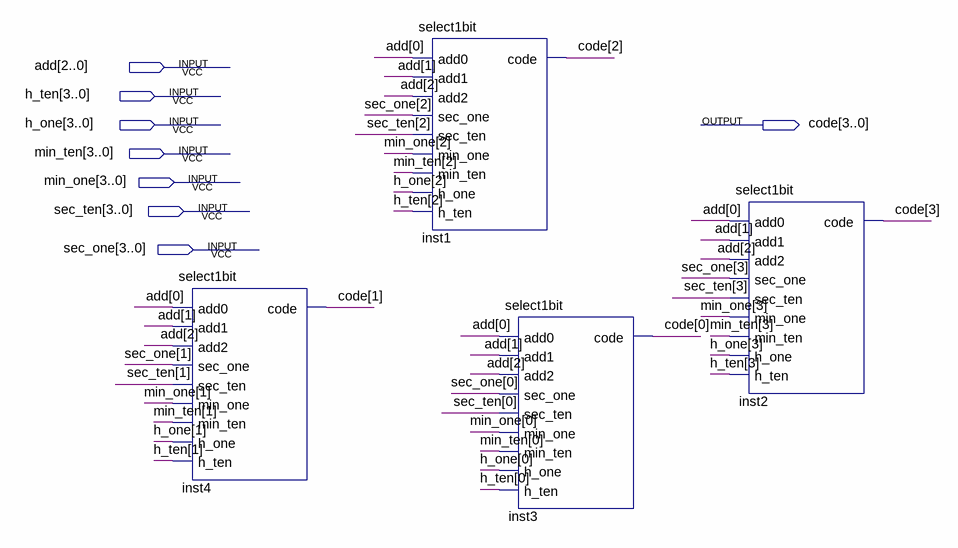
[diagram p0: schematic sheet]
// Quartus schematic seg_select.bdf as structural Verilog: 4 symbols, 8 pins
module seg_select (
  input  [2:0] add,
  input  [3:0] h_ten,
  input  [3:0] h_one,
  input  [3:0] min_ten,
  input  [3:0] min_one,
  input  [3:0] sec_ten,
  input  [3:0] sec_one,
  output [3:0] code
);

  select1bit inst4 (
    .add0(add[0]), .add1(add[1]), .add2(add[2]), .sec_one(sec_one[1]), .sec_ten(sec_ten[1]),
    .min_one(min_one[1]), .min_ten(min_ten[1]), .h_one(h_one[1]), .h_ten(h_ten[1]), .code(code[1]));
  select1bit inst1 (
    .add0(add[0]), .add1(add[1]), .add2(add[2]), .sec_one(sec_one[2]), .sec_ten(sec_ten[2]),
    .min_one(min_one[2]), .min_ten(min_ten[2]), .h_one(h_one[2]), .h_ten(h_ten[2]), .code(code[2]));
  select1bit inst3 (
    .add0(add[0]), .add1(add[1]), .add2(add[2]), .sec_one(sec_one[0]), .sec_ten(sec_ten[0]),
    .min_one(min_one[0]), .min_ten(min_ten[0]), .h_one(h_one[0]), .h_ten(h_ten[0]), .code(code[0]));
  select1bit inst2 (
    .add0(add[0]), .add1(add[1]), .add2(add[2]), .sec_one(sec_one[3]), .sec_ten(sec_ten[3]),
    .min_one(min_one[3]), .min_ten(min_ten[3]), .h_one(h_one[3]), .h_ten(h_ten[3]), .code(code[3]));
endmodule
